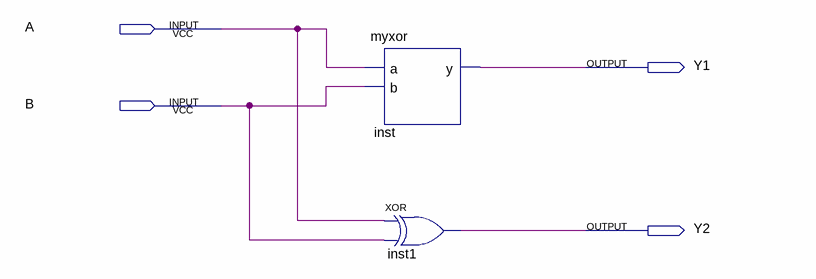
[diagram p0: schematic sheet]
// Quartus schematic demo1.bdf as structural Verilog: 2 symbols, 4 pins
module demo1 (
  input  A,
  input  B,
  output Y1,
  output Y2
);

  myxor inst (.a(A), .b(B), .y(Y1));
  xor inst1 (Y2, A, B);
endmodule
